# Altium schematic sheet mc_ds.SchDoc
size A4
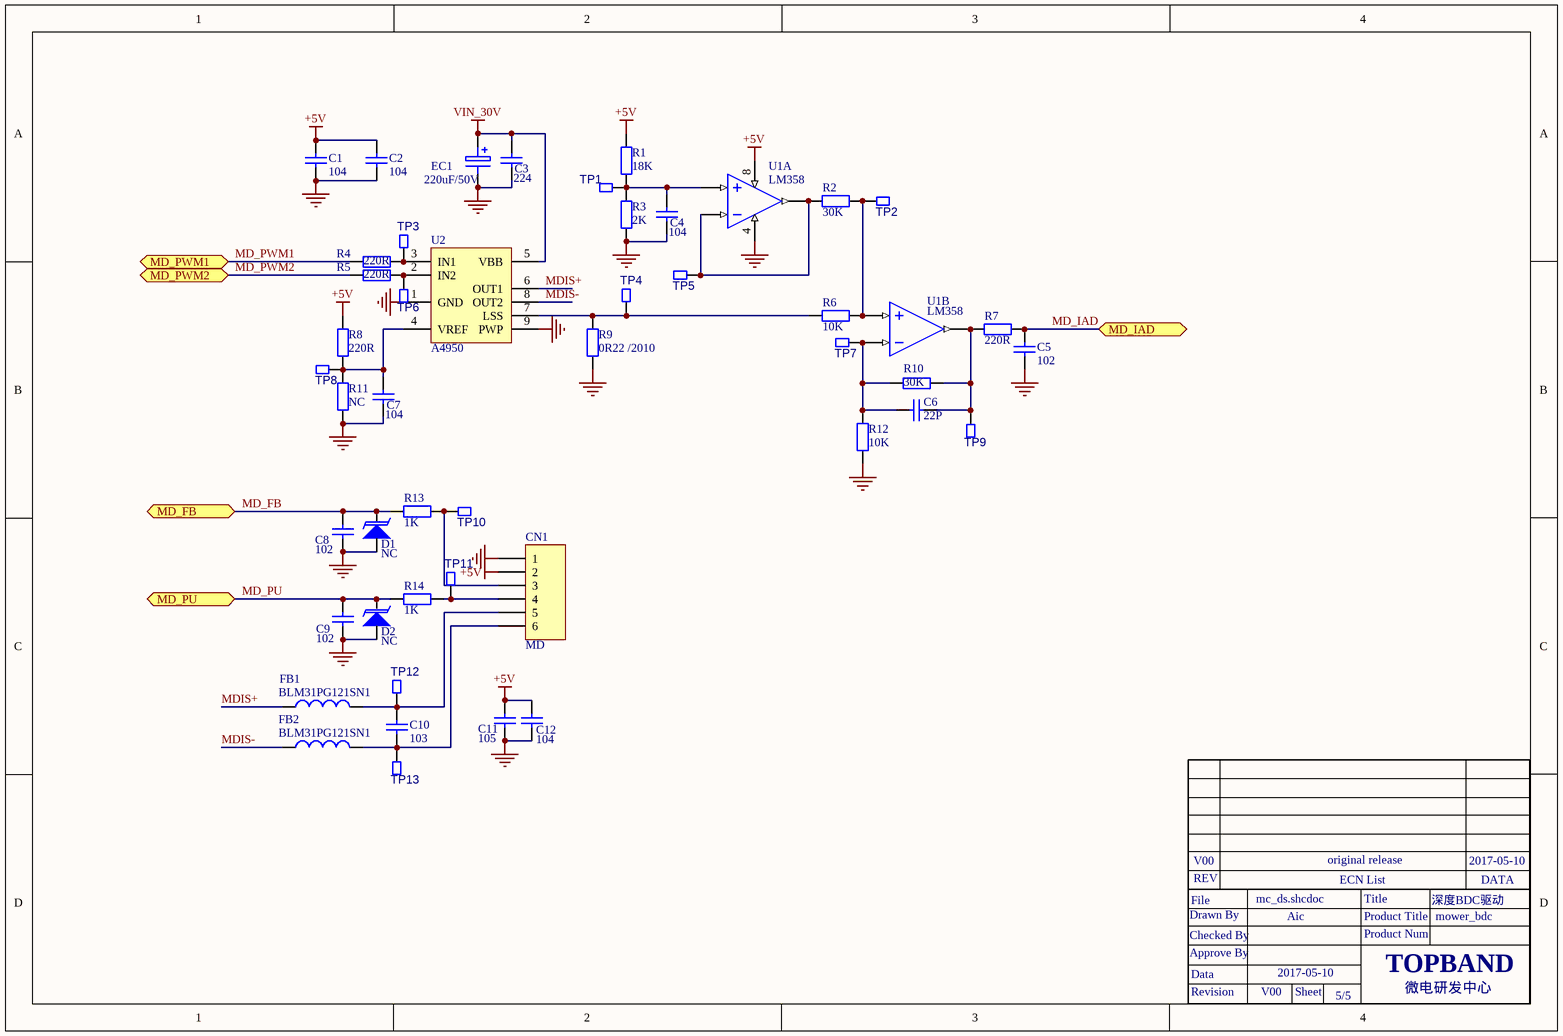
[diagram p0: mc_ds.SchDoc]

## Parts
C1  104  [0603C]
C2  104  [0603C]
C3  224  [0805C]
C4  104  [0603C]
C5  102  [0603C]
C6  22P  [0603C]
C7  104  [0603C]
C8  102  [0603C]
C9  102  [0603C]
C10  103  [0805C]
C11  105  [0805C]
C12  104  [0603C]
CN1  MD  [CON6-2.54]
D1  NC  [SOD-123]
D2  NC  [SOD-123]
EC1  220uF/50V  [EC10]
FB1  BLM31PG121SN1  [1206R]
FB2  BLM31PG121SN1  [1206R]
R1  18K  [0603R]
R2  30K  [0603R]
R3  2K  [0603R]
R4  220R  [0603R]
R5  220R  [0603R]
R6  10K  [0603R]
R7  220R  [0603R]
R8  220R  [0603R]
R9  0R22 /2010  [2010R]
R10  30K  [0603R]
R11  NC  [0603R]
R12  10K  [0603R]
R13  1K  [0603R]
R14  1K  [0603R]
TP1  TP  [TEST-0.8MM]  (value not drawn)
TP2  TP  [TEST-0.8MM]  (value not drawn)
TP3  TP  [TEST-0.8MM]  (value not drawn)
TP4  TP  [TEST-0.8MM]  (value not drawn)
TP5  TP  [TEST-0.8MM]  (value not drawn)
TP6  TP  [TEST-0.8MM]  (value not drawn)
TP7  TP  [TEST-0.8MM]  (value not drawn)
TP8  TP  [TEST-0.8MM]  (value not drawn)
TP9  TP  [TEST-0.8MM]  (value not drawn)
TP10  TP  [TEST-0.8MM]  (value not drawn)
TP11  TP  [TEST-0.8MM]  (value not drawn)
TP12  TP  [TEST-0.8MM]  (value not drawn)
TP13  TP  [TEST-0.8MM]  (value not drawn)
U1  LM358  [SO-8]  (parts A,B of 2)
U2  A4950  [SO-8 - E]

## Ports
MD_FB, MD_IAD, MD_PU, MD_PWM1, MD_PWM2

## Nets
+5V: C1.2 C2.2 C11.1 C12.1 CN1.2 R1.2 R8.1 U1.8(VCC)
GND: C1.1 C2.1 C3.1 C4.1 C5.2 C7.1 C8.2 C9.2 C11.2 C12.2 CN1.1 D1.A D2.A EC1.2 R3.1 R9.2 R11.1 R12.1 U1.4(GND) U2.1(GND) U2.9(PWP)
VIN_30V: C3.2 EC1.1 U2.5(VBB)
MD_FB: C8.1 D1.K R13.2 ; port MD_FB
MD_IAD: C5.1 R7.2 ; port MD_IAD
MD_PU: C9.1 D2.K R14.2 ; port MD_PU
MD_PWM1: R4.1 ; port MD_PWM1
MD_PWM2: R5.1 ; port MD_PWM2
MDIS+: FB1.1 U2.6(OUT1)
MDIS-: FB2.1 U2.8(OUT2)
NetC4_2: C4.2 R1.1 R3.2 TP1.1 U1.5(+IN1)
NetC6_1: C6.1 R7.1 R10.1 TP9.1 U1.1(OUT2)
NetC6_2: C6.2 R10.2 R12.2 TP7.1 U1.2(-IN2)
NetC7_2: C7.2 R8.2 R11.2 TP8.1 U2.4(VREF)
NetC10_1: C10.1 CN1.5 FB1.2 TP12.1
NetC10_2: C10.2 CN1.6 FB2.2 TP13.1
NetCN1_3: CN1.3 R13.1 TP10.1
NetCN1_4: CN1.4 R14.1 TP11.1
NetR2_1: R2.1 TP5.1 U1.6(-IN1) U1.7(OUT1)
NetR2_2: R2.2 R6.2 TP2.1 U1.3(IN2+)
NetR4_2: R4.2 TP3.1 U2.3(IN1)
NetR5_2: R5.2 TP6.1 U2.2(IN2)
NetR6_1: R6.1 R9.1 TP4.1 U2.7(LSS)

## Notes on the sheet
- Drawn By
- File
- REV
- V00
- mc_ds.shcdoc
- Aic
- original release
- ECN List
- Product Title
- Title
- 深度BDC驱动
- mower_bdc
- 2017-05-10
- DATA
- Approve By
- Checked By
- Data
- Product Num
- TOPBAND
- Revision
- Sheet
- 5/5
- 微电研发中心

## Library data of the parts
C1-C12 = Cap(0603): Component Kind: standard; Component Type: standard
CN1 = Header 6: Header, 6-Pin; LatestRevisionDate: 17-Jul-2002; LatestRevisionNote: Re-released for DXP Platform.; Publisher: Altium Limited
D1 D2 = Diode(TVS_贴片)_1: TVS管; U_TABLE: U_SAM010203; id: 28; Part Number: Diode(TVS_贴片)_1; Component Kind: standard; Component Type: standard; Pin Count: 2
EC1 = Electro(2.5mm): 120202468; U_TABLE: U_SAM010202; id: 42; Description: 电解电容; Part Number: Electro(2.5mm); Component Kind: standard; Component Type: standard; Pin Count: 2
FB1 FB2 = Inductor: 电感; U_TABLE: U_SAM010207; id: 53; Part Number: Inductor; Component Kind: Standard; Component Type: Standard; Pin Count: 2
R1 R3 R13 R14 = Res2: Resistor; Published: 8-Jun-2000; LatestRevisionDate: 17-Jul-2002; LatestRevisionNote: Re-released for DXP Platform.; PackageReference: AXIAL-0.4; Publisher: Altium Limited
  R13 R14: Value: 1K
R2 R4-R8 R10-R12 = Res2: Resistor; Value: 1K; Published: 8-Jun-2000; LatestRevisionDate: 17-Jul-2002; LatestRevisionNote: Re-released for DXP Platform.; PackageReference: AXIAL-0.4; Publisher: Altium Limited
R9 = Res2: Resistor; Value: 1K; 物料编码: 150103083; Published: 8-Jun-2000; LatestRevisionDate: 17-Jul-2002; LatestRevisionNote: Re-released for DXP Platform.; PackageReference: AXIAL-0.4; Publisher: Altium Limited
U1 = IC_LM358: 121000225; U_TABLE: U_SAM010210; Description: 集成电路; id: 83; U_ITEM_ID（物料编码）: 121000100; U_100114（SAP物料描述）: SMT运放LM358_SO-8_TI_环保; U_100047（环保属性）: 环保; U_100107（工厂BOM使用频率）: 1000:1;1500:12;3000:7;5000:14;; U_100105（工厂库存）: 1000:7508.000;1500:160.000;2000:0.000;3000:485.000;5000:1542.000;; U_100117（工厂采购量）: 1000:7500.000;1500:300.000;3000:2500.000;5000:7500.000;; Part Number: IC_LM358; Component Kind: standard; Component Type: standard; Designator: IC_LM358; Footprint: DIP14; Pin Count: 8; U_100076（型号）: LM358; U_100040（封装方式）: SO-8; U_100086（指定供应商）: TI